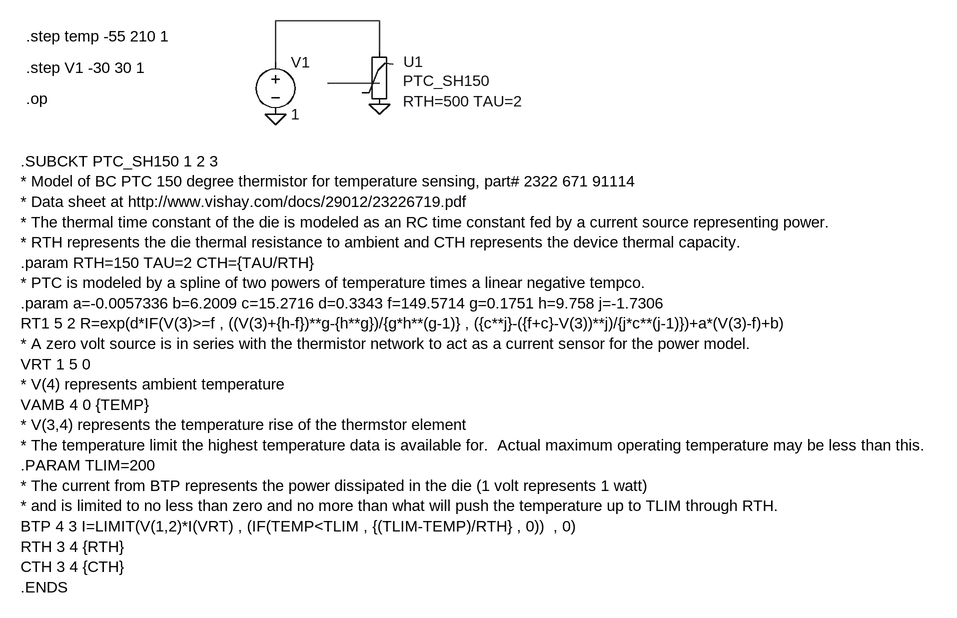
[diagram p0: schematic ptc150sh.asc]
ptc150sh.asc, the LTspice schematic file:
Version 4
SHEET 1 2012 1104
WIRE 208 96 208 32
WIRE 368 32 208 32
WIRE 368 80 368 32
WIRE 368 128 288 128
FLAG 368 160 0
FLAG 208 176 0
SYMBOL voltage 208 80 R0
WINDOW 123 0 0 Left 0
WINDOW 39 0 0 Left 0
SYMATTR InstName V1
SYMATTR Value 1
SYMBOL PTC_resistor 352 64 R0
SYMATTR InstName U1
SYMATTR SpiceModel PTC_SH150
TEXT -184 248 Left 0 !.SUBCKT PTC_SH150 1 2 3 \n* Model of BC PTC 150 degree thermistor for temperature sensing, part# 2322 671 91114\n* Data sheet at http://www.vishay.com/docs/29012/23226719.pdf\n* The thermal time constant of the die is modeled as an RC time constant fed by a current source representing power.\n* RTH represents the die thermal resistance to ambient and CTH represents the device thermal capacity.\n.param RTH=150 TAU=2 CTH={TAU/RTH} \n* PTC is modeled by a spline of two powers of temperature times a linear negative tempco. \n.param a=-0.0057336 b=6.2009 c=15.2716 d=0.3343 f=149.5714 g=0.1751 h=9.758 j=-1.7306\nRT1 5 2 R=exp(d*IF(V(3)>=f , ((V(3)+{h-f})**g-{h**g})/{g*h**(g-1)} , ({c**j}-({f+c}-V(3))**j)/{j*c**(j-1)})+a*(V(3)-f)+b) \n* A zero volt source is in series with the thermistor network to act as a current sensor for the power model.\nVRT 1 5 0 \n* V(4) represents ambient temperature\nVAMB 4 0 {TEMP}\n* V(3,4) represents the temperature rise of the thermstor element\n* The temperature limit the highest temperature data is available for.  Actual maximum operating temperature may be less than this.\n.PARAM TLIM=200\n* The current from BTP represents the power dissipated in the die (1 volt represents 1 watt)\n* and is limited to no less than zero and no more than what will push the temperature up to TLIM through RTH.\nBTP 4 3 I=LIMIT(V(1,2)*I(VRT) , (IF(TEMP<TLIM , {(TLIM-TEMP)/RTH} , 0))  , 0)\nRTH 3 4 {RTH}\nCTH 3 4 {CTH}\n.ENDS
TEXT -176 152 Left 0 !.op
TEXT -176 56 Left 0 !.step temp -55 210 1
TEXT -176 104 Left 0 !.step V1 -30 30 1

The netlist it stands for:
* ptc150sh.asc
V1 N001 0 1
XU1 N001 0 N002 PTC_SH150 RTH=500 TAU=2  ; pins A B A1
.SUBCKT PTC_SH150 1 2 3
* Model of BC PTC 150 degree thermistor for temperature sensing, part# 2322 671 91114
* Data sheet at http://www.vishay.com/docs/29012/23226719.pdf
* The thermal time constant of the die is modeled as an RC time constant fed by a current source representing power.
* RTH represents the die thermal resistance to ambient and CTH represents the device thermal capacity.
.param RTH=150 TAU=2 CTH={TAU/RTH}
* PTC is modeled by a spline of two powers of temperature times a linear negative tempco.
.param a=-0.0057336 b=6.2009 c=15.2716 d=0.3343 f=149.5714 g=0.1751 h=9.758 j=-1.7306
RT1 5 2 R=exp(d*IF(V(3)>=f , ((V(3)+{h-f})**g-{h**g})/{g*h**(g-1)} , ({c**j}-({f+c}-V(3))**j)/{j*c**(j-1)})+a*(V(3)-f)+b)
* A zero volt source is in series with the thermistor network to act as a current sensor for the power model.
VRT 1 5 0
* V(4) represents ambient temperature
VAMB 4 0 {TEMP}
* V(3,4) represents the temperature rise of the thermstor element
* The temperature limit the highest temperature data is available for.  Actual maximum operating temperature may be less than this.
.PARAM TLIM=200
* The current from BTP represents the power dissipated in the die (1 volt represents 1 watt)
* and is limited to no less than zero and no more than what will push the temperature up to TLIM through RTH.
BTP 4 3 I=LIMIT(V(1,2)*I(VRT) , (IF(TEMP<TLIM , {(TLIM-TEMP)/RTH} , 0))  , 0)
RTH 3 4 {RTH}
CTH 3 4 {CTH}
.ENDS
.op
.step temp -55 210 1
.step V1 -30 30 1
.backanno
.end